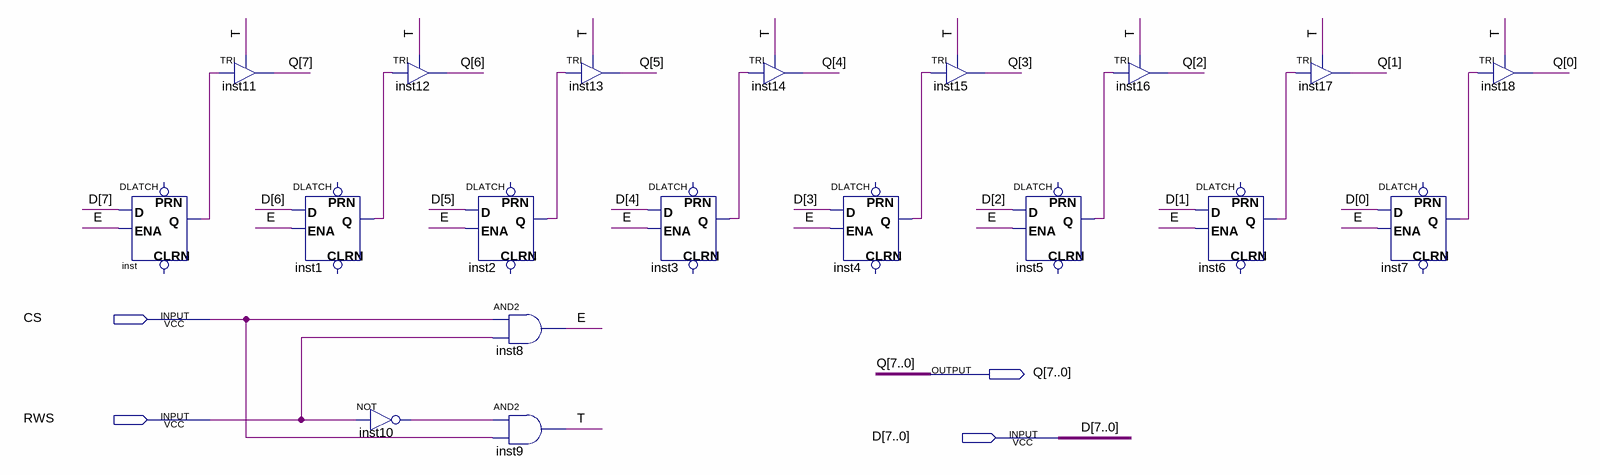
[diagram p0: schematic sheet]
// Quartus schematic WORD_8_bit.bdf as structural Verilog: 19 symbols, 4 pins
module WORD_8_bit (
  input  CS,
  input  RWS,
  input  [7:0] D,
  output [7:0] Q
);

  wire E, inst1_q, inst2_q, inst3_q, inst4_q, inst5_q, inst6_q, inst7_q, inst10_out, inst_q, T;

  DLATCH inst (.D(D[7]), .ENA(E), .Q(inst_q));  // open: CLRN, PRN
  TRI inst11 (.IN(inst_q), .OE(T), .OUT(Q[7]));
  DLATCH inst1 (.D(D[6]), .ENA(E), .Q(inst1_q));  // open: CLRN, PRN
  not inst10 (inst10_out, RWS);
  TRI inst12 (.IN(inst1_q), .OE(T), .OUT(Q[6]));
  DLATCH inst2 (.D(D[5]), .ENA(E), .Q(inst2_q));  // open: CLRN, PRN
  and inst8 (E, CS, RWS);
  and inst9 (T, inst10_out, CS);
  TRI inst13 (.IN(inst2_q), .OE(T), .OUT(Q[5]));
  DLATCH inst3 (.D(D[4]), .ENA(E), .Q(inst3_q));  // open: CLRN, PRN
  TRI inst14 (.IN(inst3_q), .OE(T), .OUT(Q[4]));
  DLATCH inst4 (.D(D[3]), .ENA(E), .Q(inst4_q));  // open: CLRN, PRN
  TRI inst15 (.IN(inst4_q), .OE(T), .OUT(Q[3]));
  DLATCH inst5 (.D(D[2]), .ENA(E), .Q(inst5_q));  // open: CLRN, PRN
  TRI inst16 (.IN(inst5_q), .OE(T), .OUT(Q[2]));
  DLATCH inst6 (.D(D[1]), .ENA(E), .Q(inst6_q));  // open: CLRN, PRN
  TRI inst17 (.IN(inst6_q), .OE(T), .OUT(Q[1]));
  DLATCH inst7 (.D(D[0]), .ENA(E), .Q(inst7_q));  // open: CLRN, PRN
  TRI inst18 (.IN(inst7_q), .OE(T), .OUT(Q[0]));
endmodule
